# Altium schematic sheet ASK Module_Receiver_RR3-XXX.SchDoc
size 101 x 63 mm
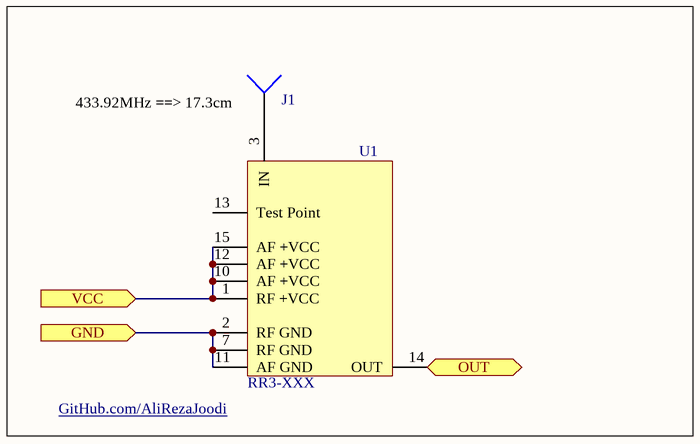
[diagram p0: ASK Module_Receiver_RR3-XXX.SchDoc]

## Parts
J1  COAX-F  [PIN1]  (value not drawn)
U1  RR3-XXX  [RR3-XXX]

## Ports
GND (in), OUT (out), VCC (in)

## Nets
GND: U1.2(RF_GND) U1.7(RF_GND) U1.11(AF_GND) ; port GND
OUT: U1.14(OUT) ; port OUT
VCC: U1.1(RF_+VCC) U1.10(AF_+VCC) U1.12(AF_+VCC) U1.15(AF_+VCC) ; port VCC
NetJ1_1: J1.1(A) U1.3(IN)

Not connected (* = marked no-connect by the designer): U1 13(Test_Point)

## Notes on the sheet
- (near J1) 433.92MHz ==> 17.3cm
- (near U1) GitHub.com/AliRezaJoodi

## Library data of the parts
J1 = COAX-F: Coax-F Connector; Manufacturer: Generic Components; Revision: July-2002: Re-released for DXP Platform.; Publisher: Altium Limited; Class I: Connector
U1 = RR3-XXX: ASK RF Model